# EAGLE schematic ioboard (EAGLE 9.6.2)
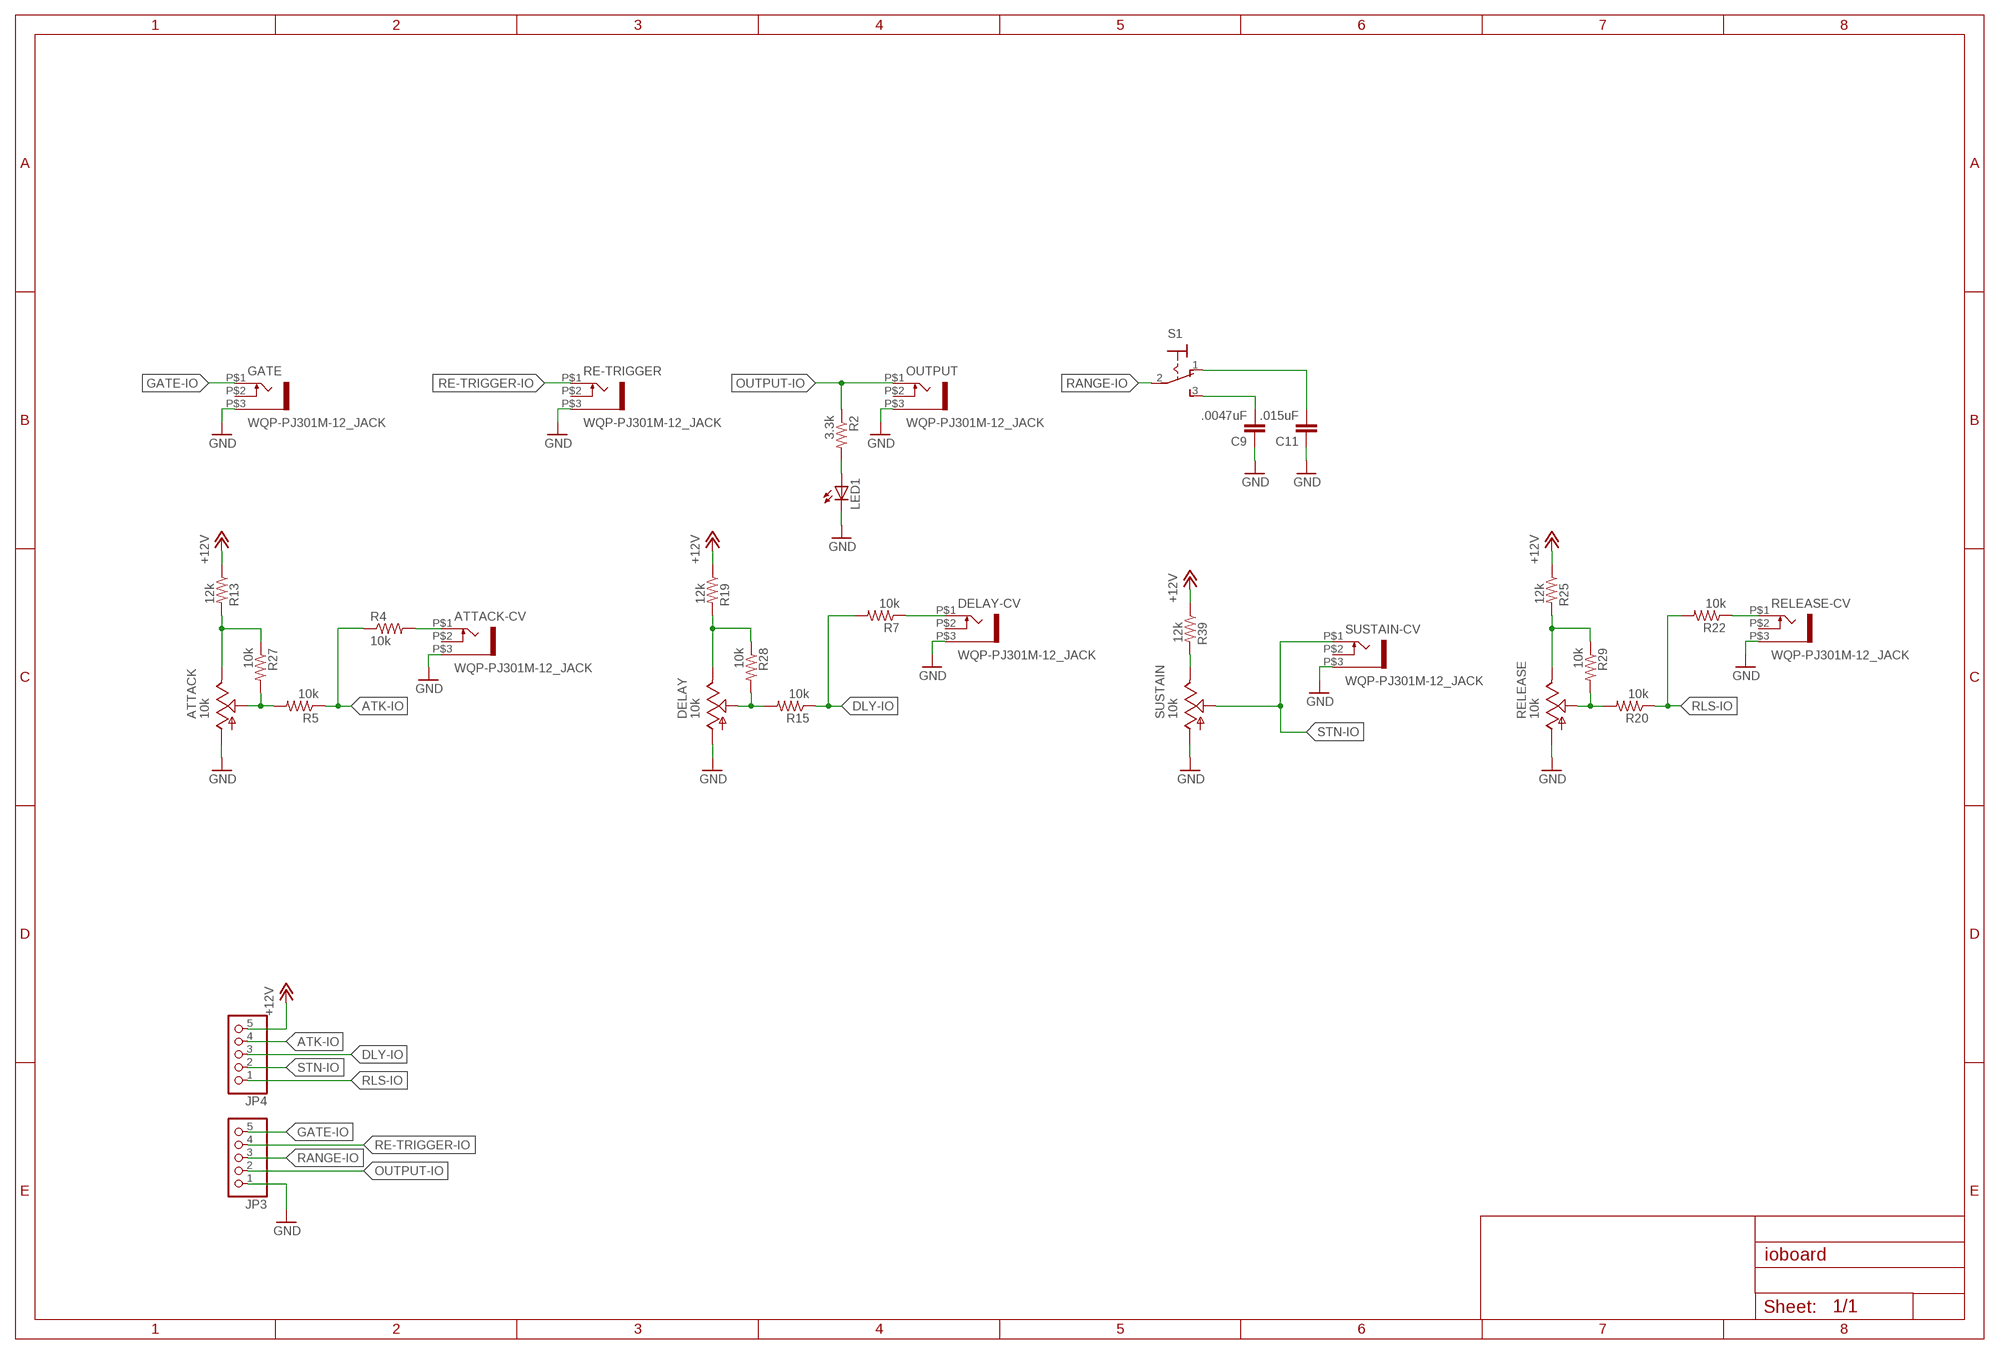
[diagram p0: schematic, sheet 1]

## Parts
ATTACK  10k  ALPHA-9MMA  [EVUF]
ATTACK-CV  WQP-PJ301M-12_JACK  [WQP-PJ301M-12_JACK]
C9  .0047uF  C-EU050-024X044  [C050-024X044]
C11  .015uF  C-EU050-024X044  [C050-024X044]
DELAY  10k  ALPHA-9MMA  [EVUF]
DELAY-CV  WQP-PJ301M-12_JACK  [WQP-PJ301M-12_JACK]
GATE  WQP-PJ301M-12_JACK  [WQP-PJ301M-12_JACK]
JP3  PINHD-1X5  [1X05]
JP4  PINHD-1X5  [1X05]
LED1  LED5MM  [LED5MM]
OUTPUT  WQP-PJ301M-12_JACK  [WQP-PJ301M-12_JACK]
R2  3.3k  R-US_0207/7  [0207/7]
R4  10k  R-US_0207/7  [0207/7]
R5  10k  R-US_0207/7  [0207/7]
R7  10k  R-US_0207/7  [0207/7]
R13  12k  R-US_0207/7  [0207/7]
R15  10k  R-US_0207/7  [0207/7]
R19  12k  R-US_0207/7  [0207/7]
R20  10k  R-US_0207/7  [0207/7]
R22  10k  R-US_0207/7  [0207/7]
R25  12k  R-US_0207/7  [0207/7]
R27  10k  R-US_0207/7  [0207/7]
R28  10k  R-US_0207/7  [0207/7]
R29  10k  R-US_0207/7  [0207/7]
R39  12k  R-US_0207/7  [0207/7]
RE-TRIGGER  WQP-PJ301M-12_JACK  [WQP-PJ301M-12_JACK]
RELEASE  10k  ALPHA-9MMA  [EVUF]
RELEASE-CV  WQP-PJ301M-12_JACK  [WQP-PJ301M-12_JACK]
S1  M9040P  [M9040P]
SUSTAIN  10k  ALPHA-9MMA  [EVUF]
SUSTAIN-CV  WQP-PJ301M-12_JACK  [WQP-PJ301M-12_JACK]

## Nets
+12V: JP4.5 R13.1 R19.1 R25.1 R39.1
ATK-IO: JP4.4 R4.1 R5.1
ATTACK-CV: ATTACK-CV.P$1 R4.2
DELAY-VC: DELAY-CV.P$1 R7.1
DLY-IO: JP4.3 R7.2 R15.1
GATE-IO: GATE.P$1 JP3.5
GND: ATTACK-CV.P$3 ATTACK.1(A) C9.1 C11.1 DELAY-CV.P$3 DELAY.1(A) GATE.P$3 JP3.1 LED1.K(C) OUTPUT.P$3 RE-TRIGGER.P$3 RELEASE-CV.P$3 RELEASE.1(A) SUSTAIN-CV.P$3 SUSTAIN.1(A)
N$2: C9.2 S1.3(S)
N$3: C11.2 S1.1(O)
N$7: ATTACK.2(S) R5.2 R27.2
N$8: ATTACK.3(E) R13.2 R27.1
N$10: DELAY.3(E) R19.2 R28.1
N$11: DELAY.2(S) R15.2 R28.2
N$13: R20.2 R29.2 RELEASE.2(S)
N$14: R25.2 R29.1 RELEASE.3(E)
N$25: LED1.A R2.2
N$32: R39.2 SUSTAIN.3(E)
OUTPUT-IO: JP3.2 OUTPUT.P$1 R2.1
RANGE-IO: JP3.3 S1.2(P)
RE-TRIGGER-IO: JP3.4 RE-TRIGGER.P$1
RELEASE-CV: R22.1 RELEASE-CV.P$1
RLS-IO: JP4.1 R20.1 R22.2
STN-IO: JP4.2 SUSTAIN-CV.P$1 SUSTAIN.2(S)
Unconnected: ATTACK-CV.P$2 DELAY-CV.P$2 GATE.P$2 OUTPUT.P$2 RE-TRIGGER.P$2 RELEASE-CV.P$2 SUSTAIN-CV.P$2

## Library data of the parts
ATTACK DELAY RELEASE SUSTAIN = TomW:ALPHA-9MM: 9 mm Square Rotary Potentiometers Source: Panasonic
ATTACK-CV DELAY-CV GATE OUTPUT RE-TRIGGER RELEASE-CV SUSTAIN-CV = thonkiconn:WQP-PJ301M-12_JACK
C9 C11 = resistor:C-EU: CAPACITOR, European symbol
JP3 JP4 = pinhead:PINHD-1X5: PIN HEADER
LED1 = led:LED: LED OSRAM: - CHIPLED LG R971, LG N971, LY N971, LG Q971, LY Q971, LO R971, LY R971 LH N974, LH R974 LS Q976, LO Q976, LY Q976 LO Q996 - Hyper CHIPLED LW Q18S LB Q993, LB Q99A, LB R99A - SideLED LS A670, LO A670, LY A670, LG A670, LP A670 LB A673, LV A673, LT A673, LW A673 LH A674 LY A675 LS A676, LA A676, LO A676, LY A676, LW A676 LS A679, LY A679, LG A679 - Hyper Micro SIDELED® LS Y876, LA Y876, LO Y876, LY Y876 LT Y87S - SmartLED LW L88C, LW L88S LB L89C, LB L89S, LG L890 LS L89K, LO L89K, LY L89K LS L896, LA L896, LO L896, LY L896 - TOPLED LS T670, LO T670, LY T670, LG T670, LP T670 LSG T670, LSP T670, LSY T670, LOP T670, LYG T670 LG T671, LOG T671, LSG T671 LB T673, LV T673, LT T673, LW T673 LH T674 LS T676, LA T676, LO T676, LY T676, LB T676, LH T676, LSB T676, LW T676 LB T67C, LV T67C, LT T67C, LS T67K, LO T67K, LY T67K, LW E67C LS E67B, LA E67B, LO E67B, LY E67B, LB E67C, LV E67C, LT E67C LW T67C LS T679, LY T679, LG T679 LS T770, LO T770, LY T770, LG T770, LP T770 LB T773, LV T773, LT T773, LW T773 LH T774 LS E675, LA E675, LY E675, LS T675 LS T776, LA T776, LO T776, LY T776, LB T776 LHGB T686 LT T68C, LB T68C - Hyper Mini TOPLED® LB M676 - Mini TOPLED Santana® LG M470 LS M47K, LO M47K, LY M47K Source: http://www.osram.convergy.de LUXEON: - LUMILED® LXK2-PW12-R00, LXK2-PW12-S00, LXK2-PW14-U00, LXK2-PW14-V00 LXK2-PM12-R00, LXK2-PM12-S00, LXK2-PM14-U00 LXK2-PE12-Q00, LXK2-PE12-R00, LXK2-PE12-S00, LXK2-PE14-T00, LXK2-PE14-U00 LXK2-PB12-K00, LXK2-PB12-L00, LXK2-PB12-M00, LXK2-PB14-N00, LXK2-PB14-P00, LXK2-PB14-Q00 LXK2-PR12-L00, LXK2-PR12-M00, LXK2-PR14-Q00, LXK2-PR14-R00 LXK2-PD12-Q00, LXK2-PD12-R00, LXK2-PD12-S00 LXK2-PH12-R00, LXK2-PH12-S00 LXK2-PL12-P00, LXK2-PL12-Q00, LXK2-PL12-R00 Source: www.luxeon.com KINGBRIGHT: KA-3528ASYC Source: www.kingbright.com
R2 R4 R5 R7 R13 R15 R19 R20 R22 R25 R27-R29 R39 = resistor:R-US_: RESISTOR, American symbol
S1 = switch:M9040P: TOGGLE SWITCH Marquardt